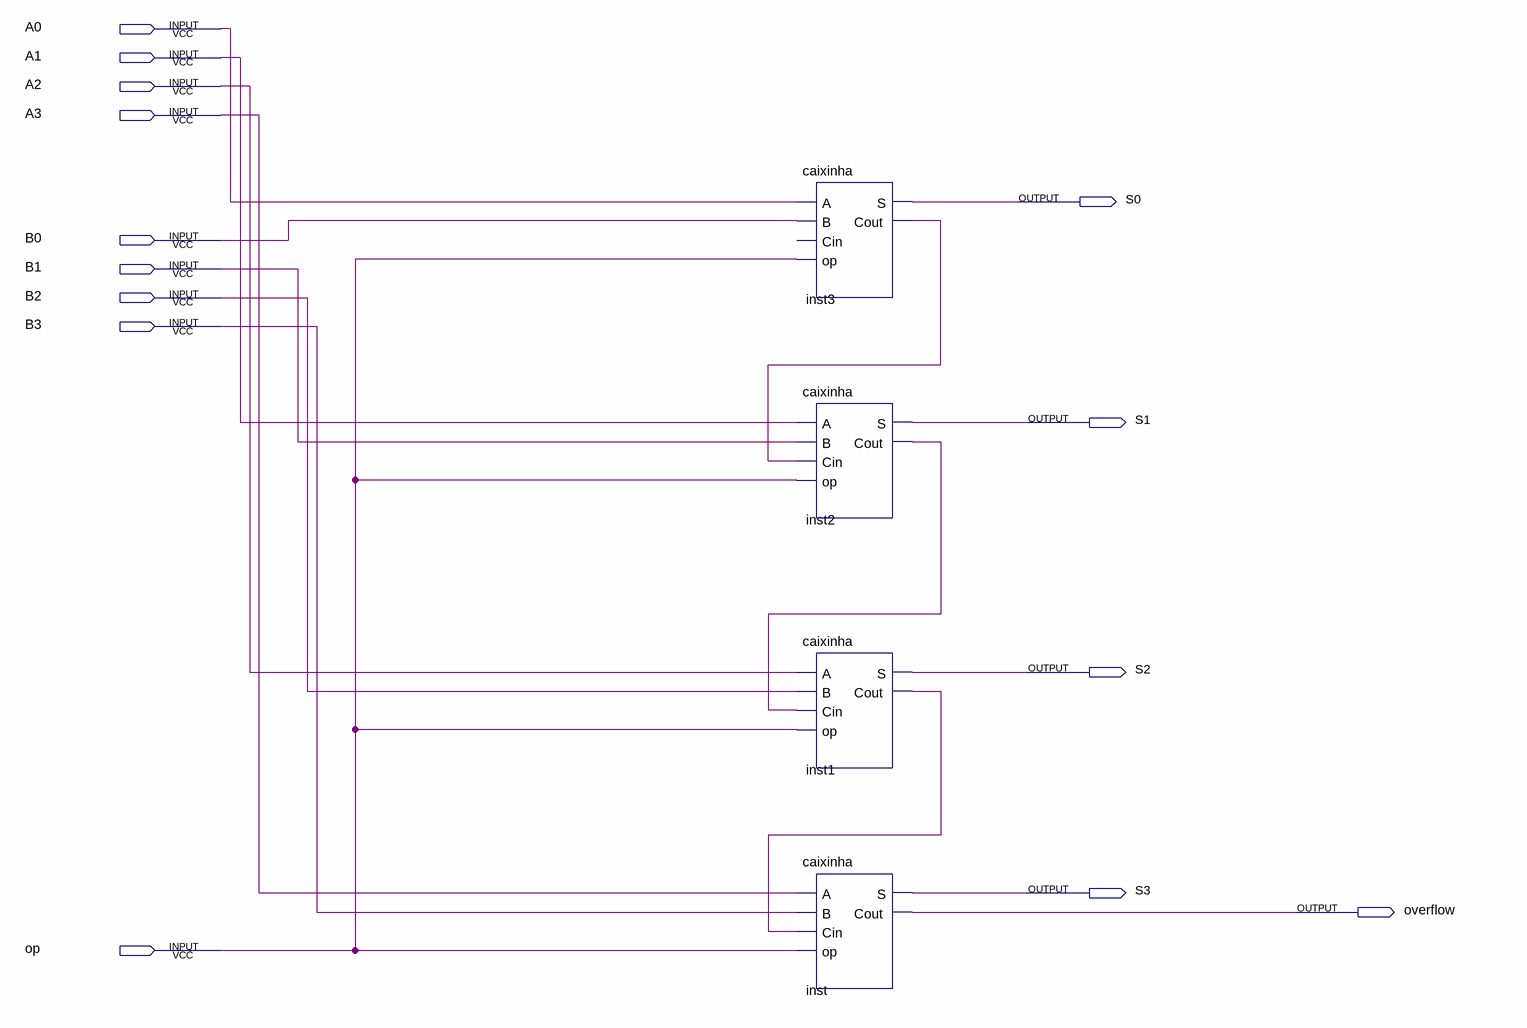
[diagram p0: schematic sheet]
// Quartus schematic somasub4bits.bdf as structural Verilog: 4 symbols, 14 pins
module somasub4bits (
  input  A0,
  input  A1,
  input  A2,
  input  A3,
  input  B0,
  input  B1,
  input  B2,
  input  B3,
  input  op,
  output S0,
  output S1,
  output S2,
  output S3,
  output overflow
);

  wire inst1_cout, inst2_cout, inst3_cout;

  caixinha inst3 (.A(A0), .B(B0), .op(op), .S(S0), .Cout(inst3_cout));  // open: Cin
  caixinha inst2 (.A(A1), .B(B1), .Cin(inst3_cout), .op(op), .S(S1), .Cout(inst2_cout));
  caixinha inst1 (.A(A2), .B(B2), .Cin(inst2_cout), .op(op), .S(S2), .Cout(inst1_cout));
  caixinha inst (.A(A3), .B(B3), .Cin(inst1_cout), .op(op), .S(S3), .Cout(overflow));
endmodule
